# EAGLE design tdt_rereference (EAGLE 8.1.0)
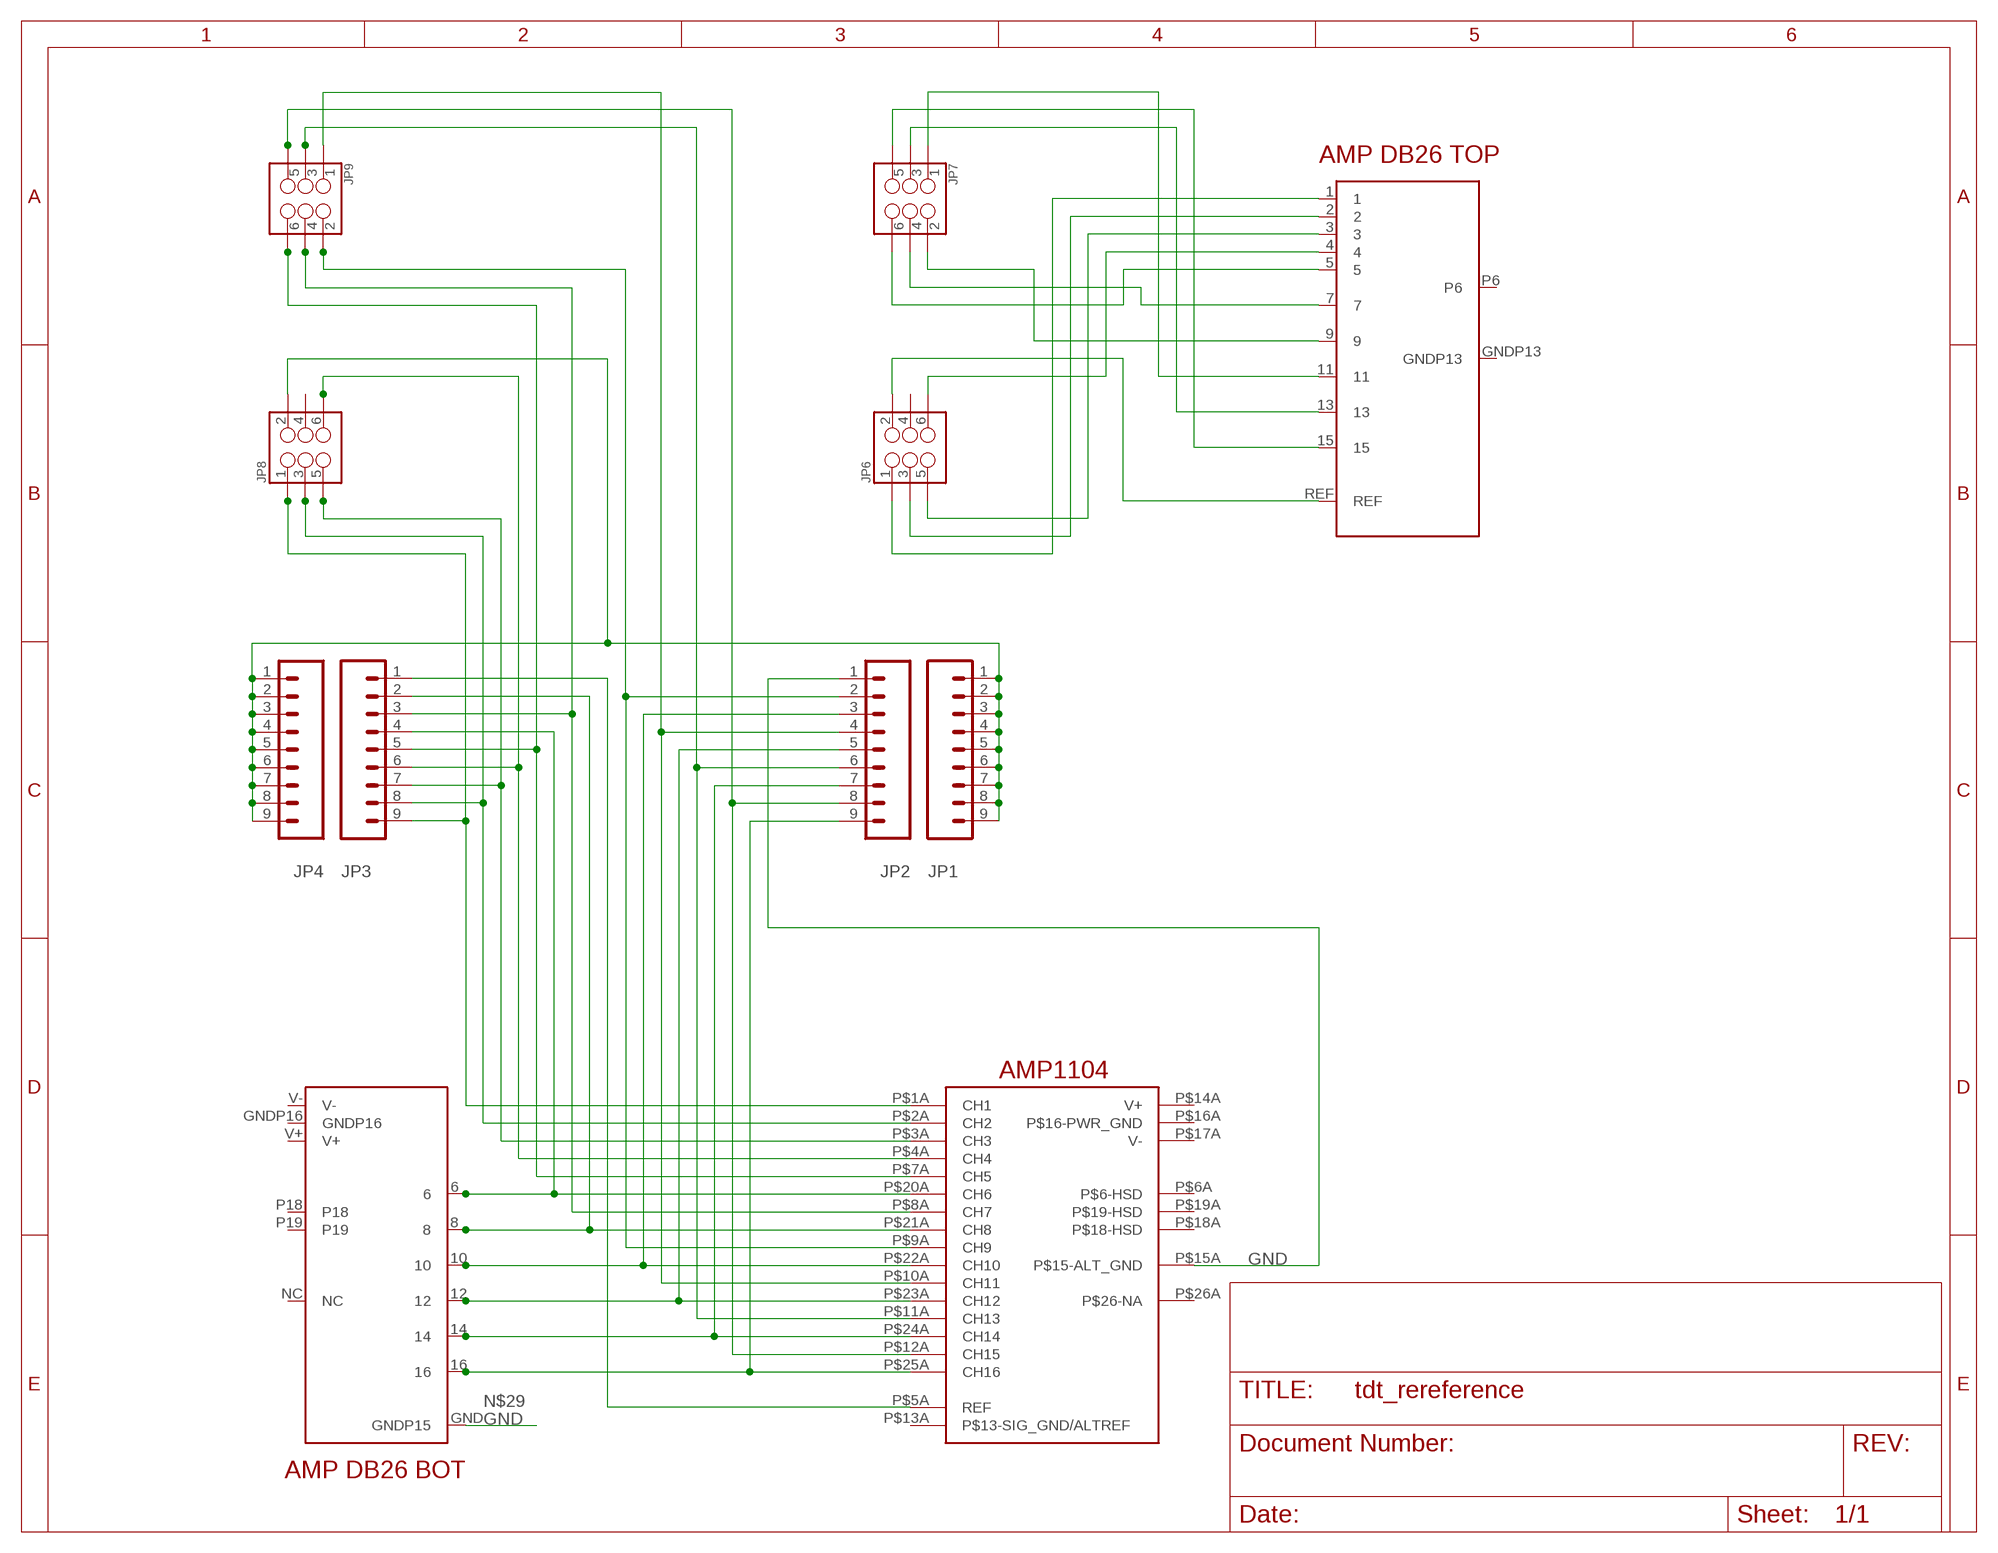
[diagram p0: schematic, sheet 1]

## Parts
JP1  M09  [1X09]
JP2  M09  [1X09]
JP3  M09  [1X09]
JP4  M09  [1X09]
JP6  M03X22X3_SILK_MALE_PTH  [2X3]
JP7  M03X22X3_SILK_MALE_PTH  [2X3]
JP8  M03X22X3_SILK_MALE_PTH  [2X3]
JP9  M03X22X3_SILK_MALE_PTH  [2X3]
U$1  DB26-MALE-BOT  [DB26-MALE-BOT]
U$2  DB26-MALE-TOP  [DB26-MALE-TOP]
U$3  AMP1104  [AMP1104]

## Nets
GND: JP2.1 U$1.GND(GNDP15) U$3.P$15A(P$15-ALT_GND)
N$1: JP3.9 JP8.1 U$3.P$1A(CH1)
N$2: JP3.8 JP8.3 U$3.P$2A(CH2)
N$3: JP3.7 JP8.5 U$3.P$3A(CH3)
N$4: JP3.6 JP8.6 U$3.P$4A(CH4)
N$5: JP3.5 JP9.6 U$3.P$7A(CH5)
N$6: JP3.4 U$1.6 U$3.P$20A(CH6)
N$7: JP3.3 JP9.4 U$3.P$8A(CH7)
N$8: JP3.2 U$1.8 U$3.P$21A(CH8)
N$9: JP2.2 JP9.2 U$3.P$9A(CH9)
N$10: JP6.2 U$2.REF
N$11: JP2.4 JP9.1 U$3.P$10A(CH11)
N$12: JP2.5 U$1.12 U$3.P$23A(CH12)
N$13: JP2.6 JP9.3 U$3.P$11A(CH13)
N$14: JP2.7 U$1.14 U$3.P$24A(CH14)
N$15: JP2.8 JP9.5 U$3.P$12A(CH15)
N$16: JP2.9 U$1.16 U$3.P$25A(CH16)
N$17: JP2.3 U$1.10 U$3.P$22A(CH10)
N$18: JP6.6 U$2.4
N$19: JP6.5 U$2.3
N$20: JP6.3 U$2.2
N$21: JP6.1 U$2.1
N$22: JP7.6 U$2.5
N$23: JP7.4 U$2.7
N$24: JP7.2 U$2.9
N$25: JP7.3 U$2.13
N$26: JP7.5 U$2.15
N$27: JP7.1 U$2.11
N$29: JP3.1 U$3.P$5A(REF)
REF: JP1.1 JP1.2 JP1.3 JP1.4 JP1.5 JP1.6 JP1.7 JP1.8 JP1.9 JP4.1 JP4.2 JP4.3 JP4.4 JP4.5 JP4.6 JP4.7 JP4.8 JP4.9 JP8.2
Unconnected: JP6.4 JP8.4 U$1.GNDP16 U$1.NC U$1.P18 U$1.P19 U$1.V+ U$1.V- U$2.GNDP13 U$2.P6 U$3.P$6A(P$6-HSD) U$3.P$13A(P$13-SIG_GND/ALTREF) U$3.P$14A(V+) U$3.P$16A(P$16-PWR_GND) U$3.P$17A(V-) U$3.P$18A(P$18-HSD) U$3.P$19A(P$19-HSD) U$3.P$26A(P$26-NA)

## Library data of the parts
JP1-JP4 = SparkFun-Connectors:M09: Header 9 Standard 9-pin 0.1" header. Use with straight break away headers (SKU : PRT-00116), right angle break away headers (PRT-00553), swiss pins (PRT-00743), machine pins (PRT-00117), and female headers (PRT-00115).
JP6-JP9 = SparkFun-Connectors:M03X2: 2x3 .1" header. Shrouded, with keying- CONN-10681 SMT- CONN-11415 Pogo pins- HW-11044; PROD_ID: CONN-09701
U$1 = HDMI-DB26:DB26-MALE-BOT
U$2 = HDMI-DB26:DB26-MALE-TOP
U$3 = TDTCableConnector:AMP1104

## Board
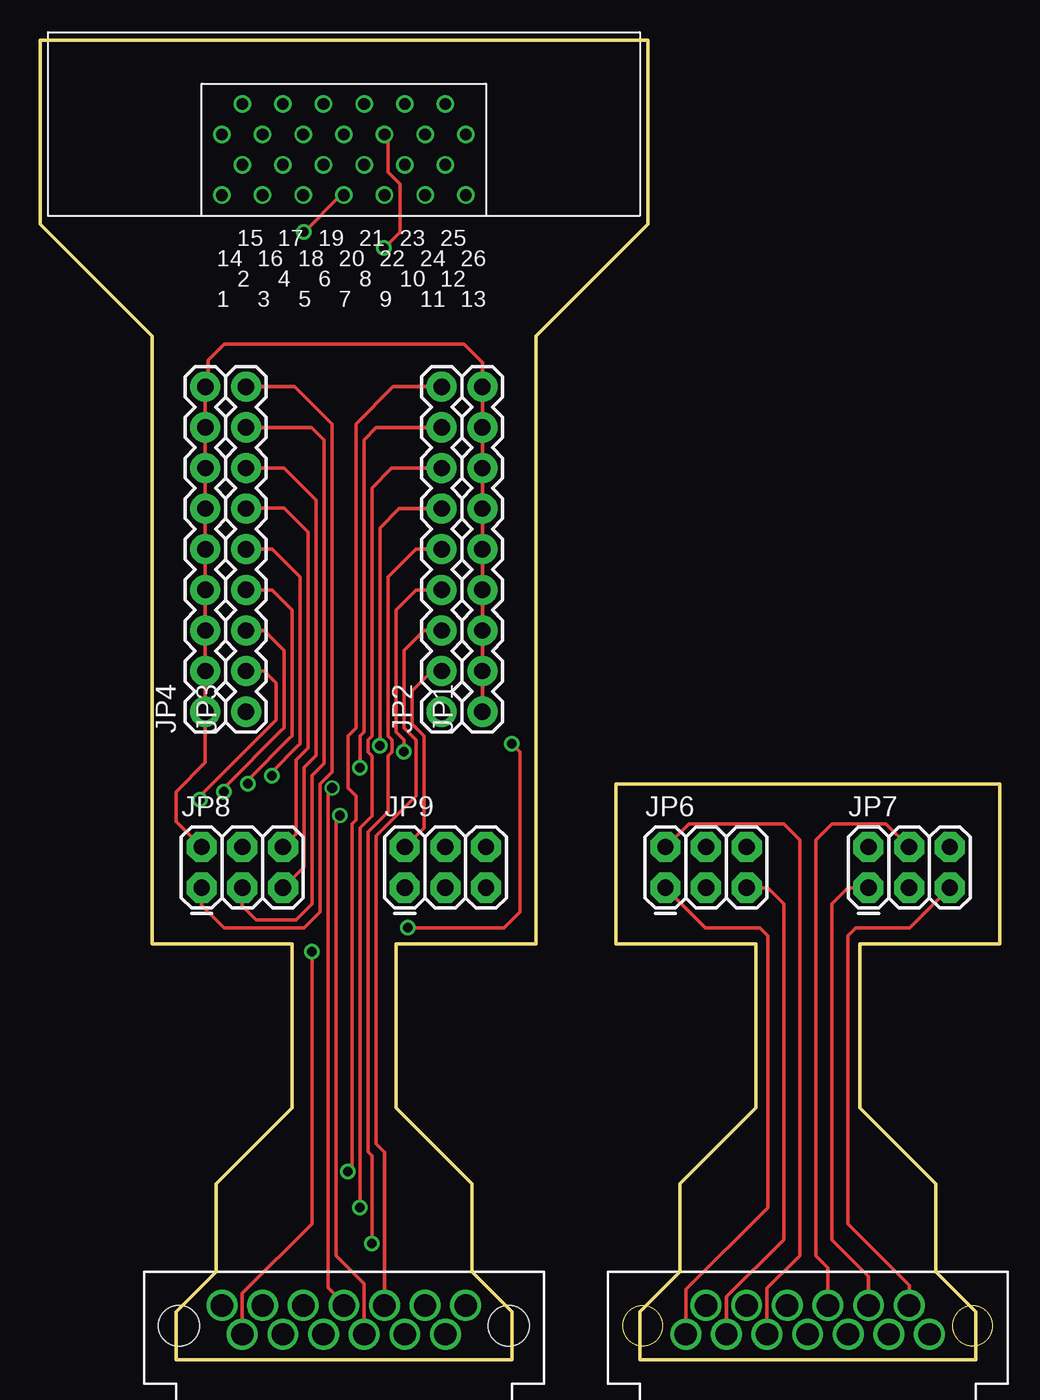
[diagram p1: board, top side]
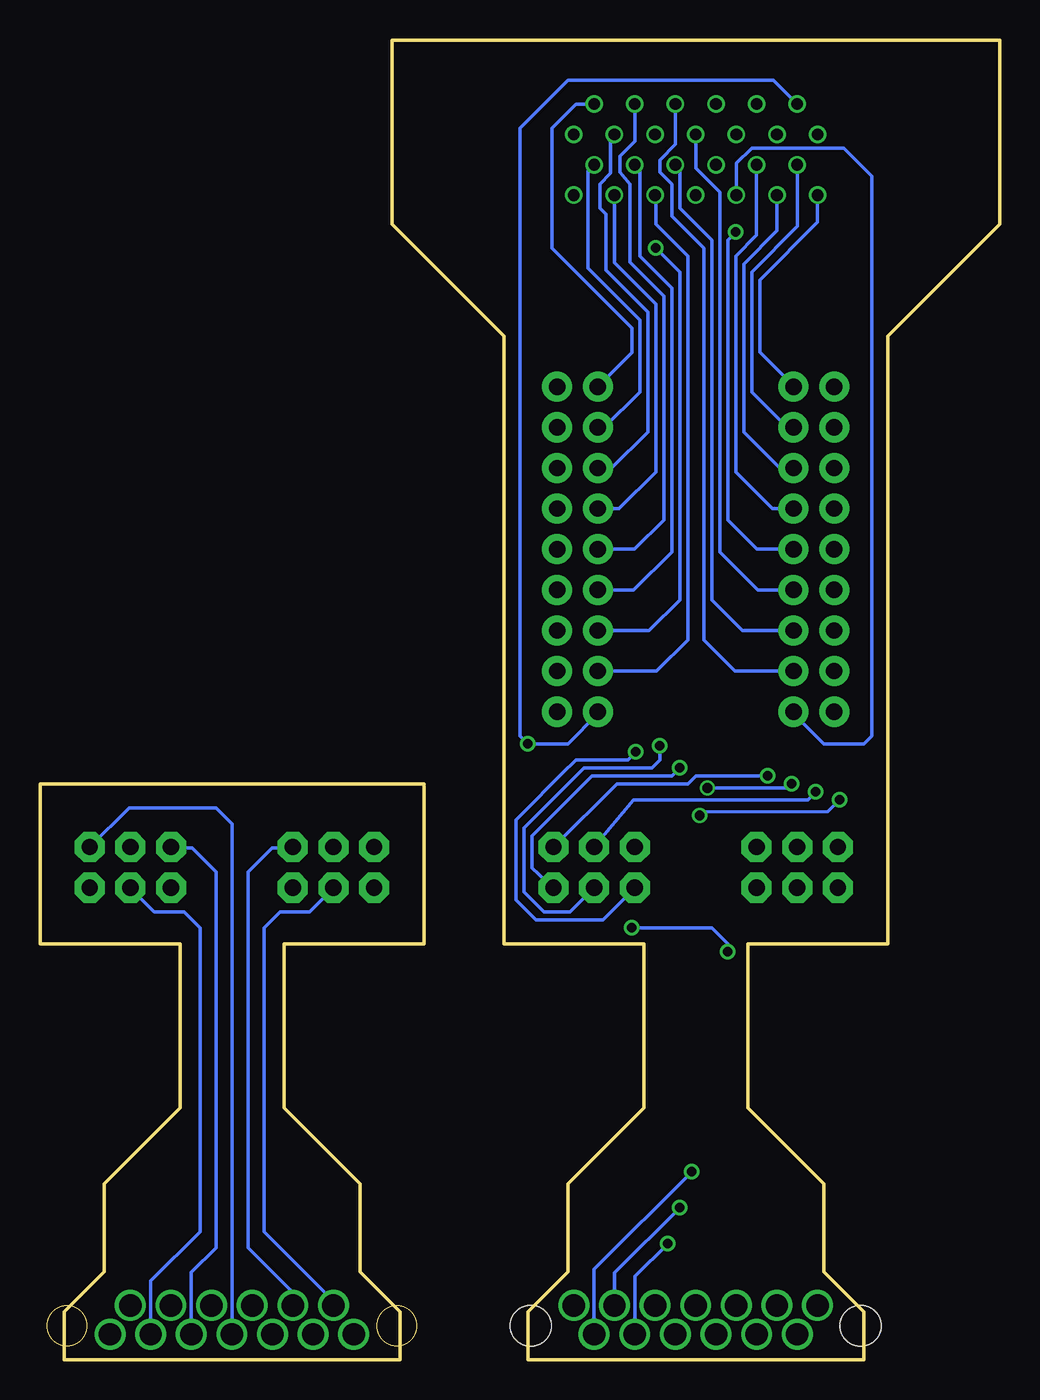
[diagram p2: board, bottom side, seen from below]

Size 60 x 82.5 mm. Coordinates in mm from the lower left corner, seen from the top.
Outline: 31,26 31,64 38,71 38,82.5 0,82.5 0,71 7,64 7,26 15.75,26 15.75,15.75 11,11 11,5.5 8.5,3 8.5,0 29.5,0 29.5,3 27,5.5 27,11 22.25,15.75 22.25,26 31,26
Outline: 58.5,0 37.5,0 37.5,3 40,5.5 40,11 44.75,15.75 44.75,26 36,26 36,36 60,36 60,26 51.25,26 51.25,15.75 56,11 56,5.5 58.5,3 58.5,0
Copper layers (1*16): Top 0.0356mm / dielectric 1.5011mm / Bottom 0.0356mm
Design rules "oshpark-2layer *": minimum track width 6mil, minimum drill 13mil, track to track 6mil, track to pad 6mil, pad to pad 6mil, via to via 6mil, smd to smd 6mil, copper to edge 15mil, drill to drill 6mil, minimum pad ring 7mil, minimum via ring 7mil, stop-mask expansion 2.5mil, vias tented up to drill 0mil, thermal gap 10mil

### Footprints (pad centres in the part's own frame; a part is rotated, then mirrored left to right if it is on the bottom)
1X09 = drill 1.016 pad 1.88: 1 0,0; 2 2.54,0; 3 5.08,0; 4 7.62,0; 5 10.16,0; 6 12.7,0; 7 15.24,0; 8 17.78,0; 9 20.32,0
2X3 = drill 1.016 pad 1.88 octagon: 1 0,0; 2 0,2.54; 3 2.54,0; 4 2.54,2.54; 5 5.08,0; 6 5.08,2.54
DB26-MALE-BOT = drill 1.4 pad 1.93: 6 0,2.12; 8 -1.27,3.92; 10 -2.54,2.12; 12 -3.81,3.92; 14 -5.08,2.12; 16 -6.35,3.92; GND 6.35,3.92; GNDP16 5.08,2.12; NC -7.62,2.12; P18 2.54,2.12; P19 1.27,3.92; V+ 7.62,2.12; V- 3.81,3.92 | hole 2.54: 10.316,3.394; -10.316,3.394
DB26-MALE-TOP = drill 1.4 pad 1.93: 1 7.62,3.92; 2 6.35,2.12; 3 5.08,3.92; 4 3.81,2.12; 5 0,3.92; 7 -1.27,2.12; 9 -2.54,3.92; 11 -3.81,2.12; 13 -5.08,3.92; 15 -6.35,2.12; GNDP13 -7.62,3.92; P6 1.27,2.12; REF 2.54,3.92
AMP1104 = drill 0.737 pad 1.092: P$1A -7.62,-5.7; P$2A -6.35,-3.8; P$3A -5.08,-5.7; P$4A -3.81,-3.8; P$5A -2.54,-5.7; P$6A -1.27,-3.8; P$7A 0,-5.7; P$8A 1.27,-3.8; P$9A 2.54,-5.7; P$10A 3.81,-3.8; P$11A 5.08,-5.7; P$12A 6.35,-3.8; P$13A 7.62,-5.7; P$14A -7.62,-1.9; P$15A -6.35,0; P$16A -5.08,-1.9; P$17A -3.81,0; P$18A -2.54,-1.9; P$19A -1.27,0; P$20A 0,-1.9; P$21A 1.27,0; P$22A 2.54,-1.9; P$23A 3.81,0; P$24A 5.08,-1.9; P$25A 6.35,0; P$26A 7.62,-1.9

### Placement (x,y rotation side)
JP1  27.66,40.5 90 top
JP2  25.12,40.5 90 top
JP3  12.88,40.5 90 top
JP4  10.34,40.5 90 top
JP6  39.11,29.5 0 top
JP7  51.81,29.5 0 top
JP8  10.11,29.5 0 top
JP9  22.81,29.5 0 top
U$1  19,5.5 180 top
U$2  48,5.5 180 top
U$3  19,78.5 0 top

### Tracks (layer width: path | path; a pad name or v marks a point on that pad's centre or on a via)
GND  (via drill 0.6)
  Top 0.203: U$1.GND 12.65,4.15 17,8.5 v17,25.5 | v23,27 29,27 30,28 30,38 v29.5,38.5
  Bottom 0.203: U$3.P$15A 14.15,80 27,80 30,77 30,39 v29.5,38.5 27,38.5 25.12,40.38 JP2.1 | v17,25.5 17,26 18,27 v23,27
N$1
  Top 0.203: JP3.9 15.93,60.82 18.25,58.5 18.25,36.75 17.5,36 17.5,28 16.5,27 11.5,27 10.11,28.39 JP8.1
  Bottom 0.203: JP3.9 12.82,60.82 15,63 15,67.5 11.38,71.12 U$3.P$1A
N$2
  Top 0.203: JP3.8 16.97,58.28 17.75,57.5 17.75,37.25 17,36.5 17,28.5 16,27.5 13.5,27.5 12.65,28.35 JP8.3
  Bottom 0.203: JP3.8 13.28,58.28 15.5,60.5 15.5,68 12.65,70.85 U$3.P$2A
N$3
  Top 0.203: JP3.7 15.25,55.75 17.25,53.75 17.25,37.76 16.5,37.01 16.5,30.81 JP8.5
  Bottom 0.203: JP3.7 13.74,55.74 16,58 16,68.5 13.92,70.58 U$3.P$3A
N$4
  Top 0.203: JP3.6 12.93,53.25 15.25,53.25 16.75,51.75 16.75,38.25 16,37.5 16,32.85 JP8.6
  Bottom 0.203: JP3.6 14.2,53.2 16.5,55.5 16.5,69 15.19,70.31 U$3.P$4A
N$5  (via drill 0.6)
  Top 0.203: U$3.P$7A 18.8,72.8 v16.5,70.5 | JP3.5 14.5,50.66 16.25,48.91 16.25,38.5 16.11,38.36 16.11,38.35 14.5,36.74 v14.5,36.5
  Bottom 0.203: JP3.5 15.16,50.66 17,52.5 17,70 v16.5,70.5 | JP9.6 23.93,36 19.5,36 19,36.5 v14.5,36.5
N$6  (via drill 0.6)
  Top 0.203: U$1.6 19,3.5 18,4.5 18,35.5 18.04,35.5 v18.27,35.73 | JP3.4 14.5,48.12 15.75,46.87 15.75,39 15.61,38.86 15.61,38.85 13,36.24 v13,36
  Bottom 0.203: JP3.4 15.12,48.12 17.5,50.5 17.5,73 19,74.5 U$3.P$20A | v18.27,35.73 13.23,35.73 v13,36
N$7  (via drill 0.6)
  Top 0.203: JP3.3 14,45.58 15.25,44.33 15.25,39.5 15.11,39.36 15.11,39.35 11.5,35.75 v11.5,35.5
  Bottom 0.203: JP3.3 16.08,45.58 18,47.5 18,70 20,72 20,74.43 U$3.P$8A | JP9.4 22.89,35 12,35 v11.5,35.5
N$8  (via drill 0.6)
  Top 0.203: U$1.8 20.27,4.73 18.5,6.5 18.5,33.77 v18.75,34.02 | JP3.2 14,43.04 14.75,42.29 14.75,40 10,35.25 v10,35
  Bottom 0.203: JP3.2 16.54,43.04 18.5,45 18.5,69.5 20.5,71.5 20.5,73.5 21.25,74.25 21.25,75 20.27,75.98 U$3.P$21A | v18.75,34.02 18.52,34.25 18.5,34.25 10.73,34.27 v10,35
N$9
  Top 0.203: JP2.2 24.5,43.04 23.25,41.79 23.25,39.75 24,39 24,33.25 23.5,32.75 23.25,32.48 JP9.2
  Bottom 0.203: JP2.2 21.46,43.04 19.5,45 19.5,69 21.5,71 21.5,72.76 U$3.P$9A
N$10
  Top 0.203: U$2.REF 45.46,4.46 47.5,6.5 47.5,32.5 46.5,33.5 40.57,33.5 JP6.2
N$11  (via drill 0.6)
  Top 0.203: JP2.4 23.5,48.12 22.25,46.87 22.25,39.25 22.75,38.75 v22.75,38
  Bottom 0.203: JP2.4 22.88,48.12 20.5,50.5 20.5,67 22.5,69 22.5,74.39 U$3.P$10A | JP9.1 24.81,27.5 29,27.5 29.14,27.64 29.15,27.64 29.98,28.48 30.23,28.73 30.23,33.73 30.25,33.75 26.98,37.02 27.35,36.64 26.5,37.5 23.25,37.5 v22.75,38
N$12  (via drill 0.6)
  Top 0.203: JP2.5 23.5,50.66 21.75,48.91 21.75,39 22,38.75 22,38 21.75,37.75 21.75,34.25 20.5,33 20.5,20 20.5,13 20.75,12.75 v20.75,7.25
  Bottom 0.203: JP2.5 22.84,50.66 21,52.5 21,66.5 23.12,68.62 23.12,73.5 23.72,74.22 23.72,75.25 22.81,76.16 U$3.P$23A | U$1.12 22.81,5.19 v20.75,7.25
N$13  (via drill 0.6)
  Top 0.203: JP2.6 22.45,53.2 21.25,52 v21.25,38.38
  Bottom 0.203: JP2.6 23.8,53.2 21.5,55.5 21.5,66 24.08,68.58 U$3.P$11A | JP9.3 26.85,28 28.5,28 29.75,29.25 29.75,33.25 26,37 21.75,37 21.25,37.5 v21.25,38.38
N$14  (via drill 0.6)
  Top 0.203: JP2.7 21.99,55.74 20.75,54.5 20.75,39 20.5,38.75 20.5,38 20.75,37.75 20.75,34 20,33.25 v20,9.5
  Bottom 0.203: JP2.7 24.26,55.74 22,58 22,65.5 24.62,68.12 24.62,71.62 25,72 25,73.5 24.33,74.17 24.33,76.4 24.08,76.65 U$3.P$24A | U$1.14 24.08,5.42 v20,9.5
N$15  (via drill 0.6)
  Top 0.203: JP2.8 21.03,58.28 20.25,57.5 20.25,39.25 20,39 v20,37
  Bottom 0.203: JP2.8 24.72,58.28 22.5,60.5 22.5,65 25.75,68.25 25.75,74.3 U$3.P$12A | JP9.5 29.25,30.73 29.25,32.75 25.5,36.5 20.5,36.5 v20,37
N$16  (via drill 0.6)
  Top 0.203: JP2.9 22.07,60.82 19.75,58.5 19.75,39.5 19.25,39 19.25,35.75 19.75,35.25 19.75,33.75 19.5,33.5 19.5,12 v19.25,11.75
  Bottom 0.203: U$3.P$25A 26.5,78.5 28,77 28,69.5 23,64.5 23,62.94 JP2.9 | U$1.16 25.35,5.65 v19.25,11.75
N$17  (via drill 0.6)
  Top 0.203: U$3.P$22A 21.75,76.39 21.75,74.25 22.5,73.5 22.5,70.5 v21.5,69.5 | JP2.3 24,45.58 22.75,44.33 22.75,39.5 23.5,38.75 23.5,35.25 22.75,34.5 22.75,34.49 21,32.75 21,20 21,13.5 21.54,12.96 U$1.10
  Bottom 0.203: JP2.3 21.92,45.58 20,47.5 20,68 v21.5,69.5
N$18
  Bottom 0.203: U$2.4 44.19,4.19 47,7 47,30.5 45.5,32 44.23,32 JP6.6
N$19
  Top 0.203: U$2.3 42.92,3.92 46.5,7.5 46.5,28.5 45.5,29.5 JP6.5
N$20
  Bottom 0.203: U$2.2 41.65,3.65 46,8 46,27 45,28 43.15,28 JP6.3
N$21
  Top 0.203: U$2.1 40.38,4.38 45.5,9.5 45.5,26.5 45,27 41.61,27 JP6.1
N$22
  Bottom 0.203: JP7.6 54.43,34.5 49,34.5 48,33.5 U$2.5
N$23
  Top 0.203: U$2.7 49.27,5.73 48.5,6.5 48.5,32.5 49.5,33.5 52.89,33.5 JP7.4
N$24
  Bottom 0.203: U$2.9 50.54,5.46 49,7 49,30.5 50.5,32 51.77,32 JP7.2
N$25
  Bottom 0.203: U$2.13 53.08,4.92 50,8 50,27 51,28 52.85,28 JP7.3
N$26
  Top 0.203: U$2.15 54.35,4.65 50.5,8.5 50.5,26.5 51,27 54.39,27 JP7.5
N$27
  Top 0.203: U$2.11 51.81,5.19 49.5,7.5 49.5,28.5 50.5,29.5 JP7.1
N$29  (via drill 0.6)
  Top 0.203: JP3.1 v12.88,40.38
  Bottom 0.203: v12.88,40.38 11,38.5 8.5,38.5 8,39 8,74 9.75,75.75 15.5,75.75 16.46,74.79 U$3.P$5A
REF
  Top 0.203: JP1.9 JP1.8 JP1.7 JP1.6 JP1.5 JP1.4 JP1.3 JP1.2 JP1.1 27.66,62.34 26.5,63.5 11.5,63.5 10.5,62.5 10.5,60.98 JP4.9 JP4.8 JP4.7 JP4.6 JP4.5 JP4.4 JP4.3 JP4.2 JP4.1 10.34,37.34 8.5,35.5 8.5,33.65 JP8.2